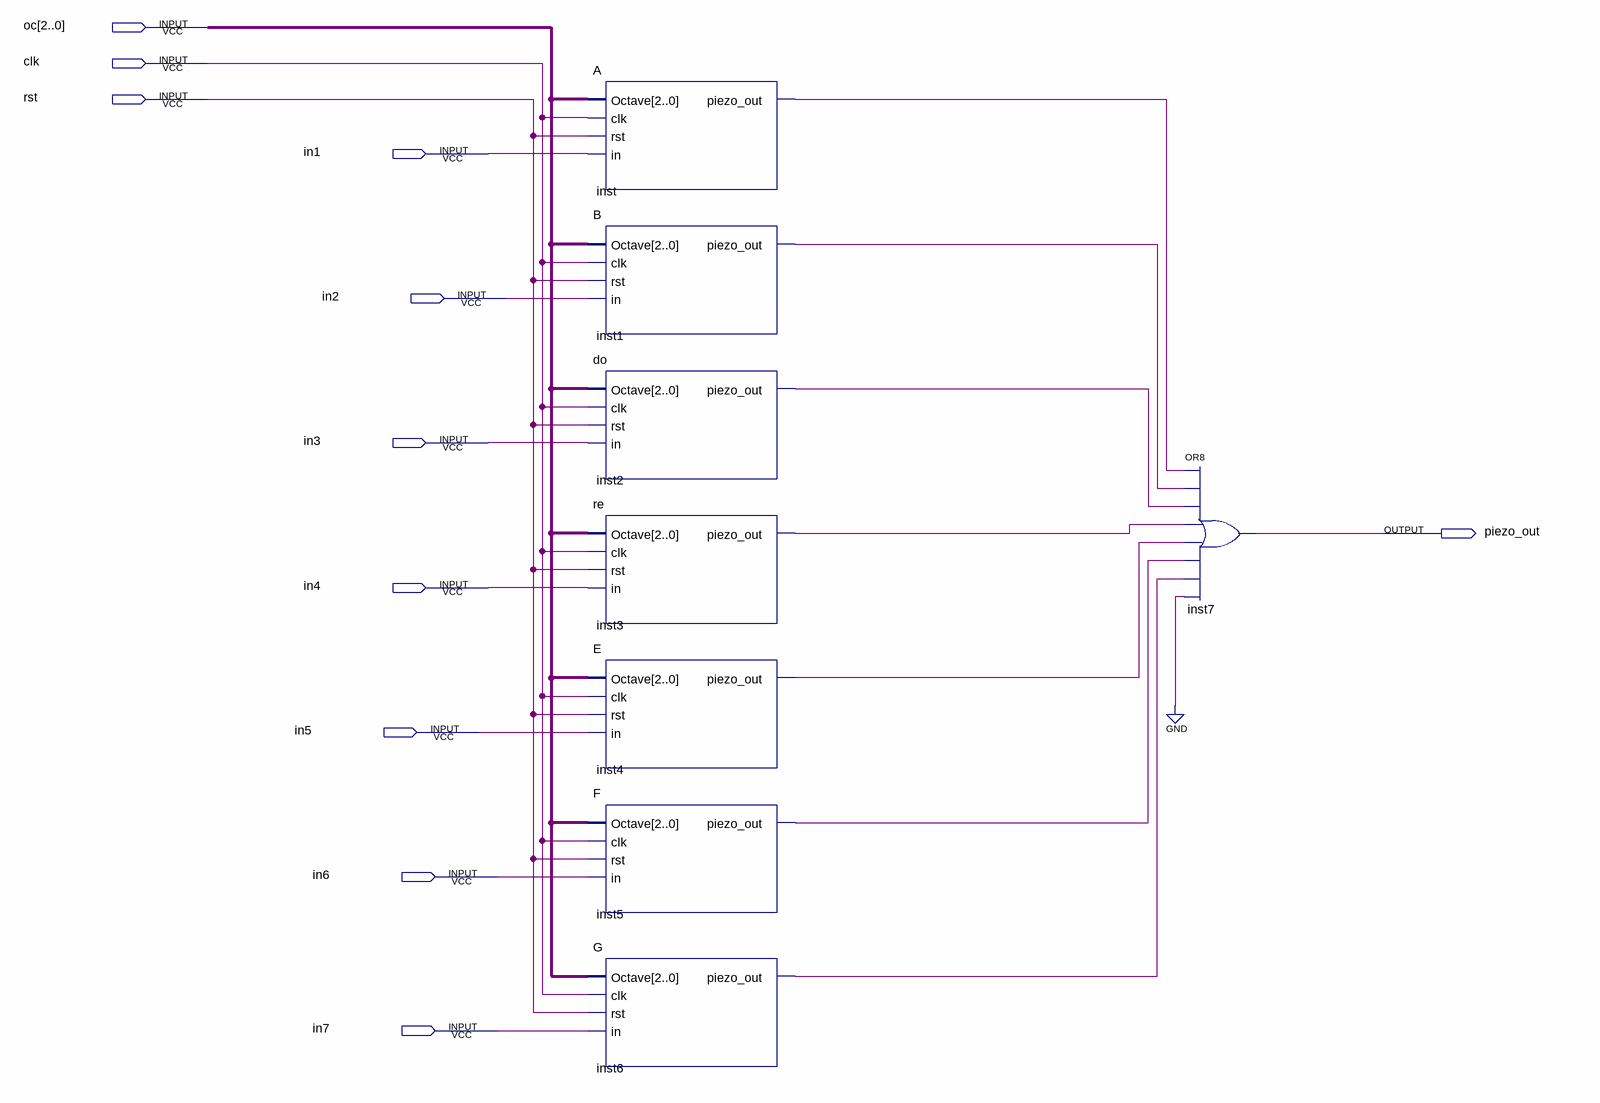
[diagram p0: schematic sheet]
// Quartus schematic Piezo_module.bdf as structural Verilog: 8 symbols, 11 pins
module Piezo_module (
  input  [2:0] oc,
  input  clk,
  input  rst,
  input  in1,
  input  in2,
  input  in3,
  input  in4,
  input  in5,
  input  in6,
  input  in7,
  output piezo_out
);

  wire inst1_piezo_out, inst2_piezo_out, inst3_piezo_out, inst4_piezo_out, inst5_piezo_out, inst6_piezo_out,
       inst_piezo_out;

  A inst (.Octave(oc), .clk(clk), .rst(rst), .in(in1), .piezo_out(inst_piezo_out));
  B inst1 (.Octave(oc), .clk(clk), .rst(rst), .in(in2), .piezo_out(inst1_piezo_out));
  \do  inst2 (.Octave(oc), .clk(clk), .rst(rst), .in(in3), .piezo_out(inst2_piezo_out));
  re inst3 (.Octave(oc), .clk(clk), .rst(rst), .in(in4), .piezo_out(inst3_piezo_out));
  E inst4 (.Octave(oc), .clk(clk), .rst(rst), .in(in5), .piezo_out(inst4_piezo_out));
  F inst5 (.Octave(oc), .clk(clk), .rst(rst), .in(in6), .piezo_out(inst5_piezo_out));
  G inst6 (.Octave(oc), .clk(clk), .rst(rst), .in(in7), .piezo_out(inst6_piezo_out));
  or inst7 (piezo_out, inst_piezo_out, inst1_piezo_out, inst2_piezo_out, inst3_piezo_out, inst4_piezo_out, inst5_piezo_out, inst6_piezo_out, 1'b0);
endmodule
